# Altium schematic sheet BlockAmpli_Mot.SchDoc: Block_Ampli_Moteur
size A3; Organization: Institut d'Automatisation Industrielle; SheetNumber: 7; SheetTotal: 8; SVN: OUI; CurrentTime: 6; CurrentDate: 5; DocumentFullPathAndName: 8; DocumentName: 9; ModifiedDate: 13; ProjectName: <projet>
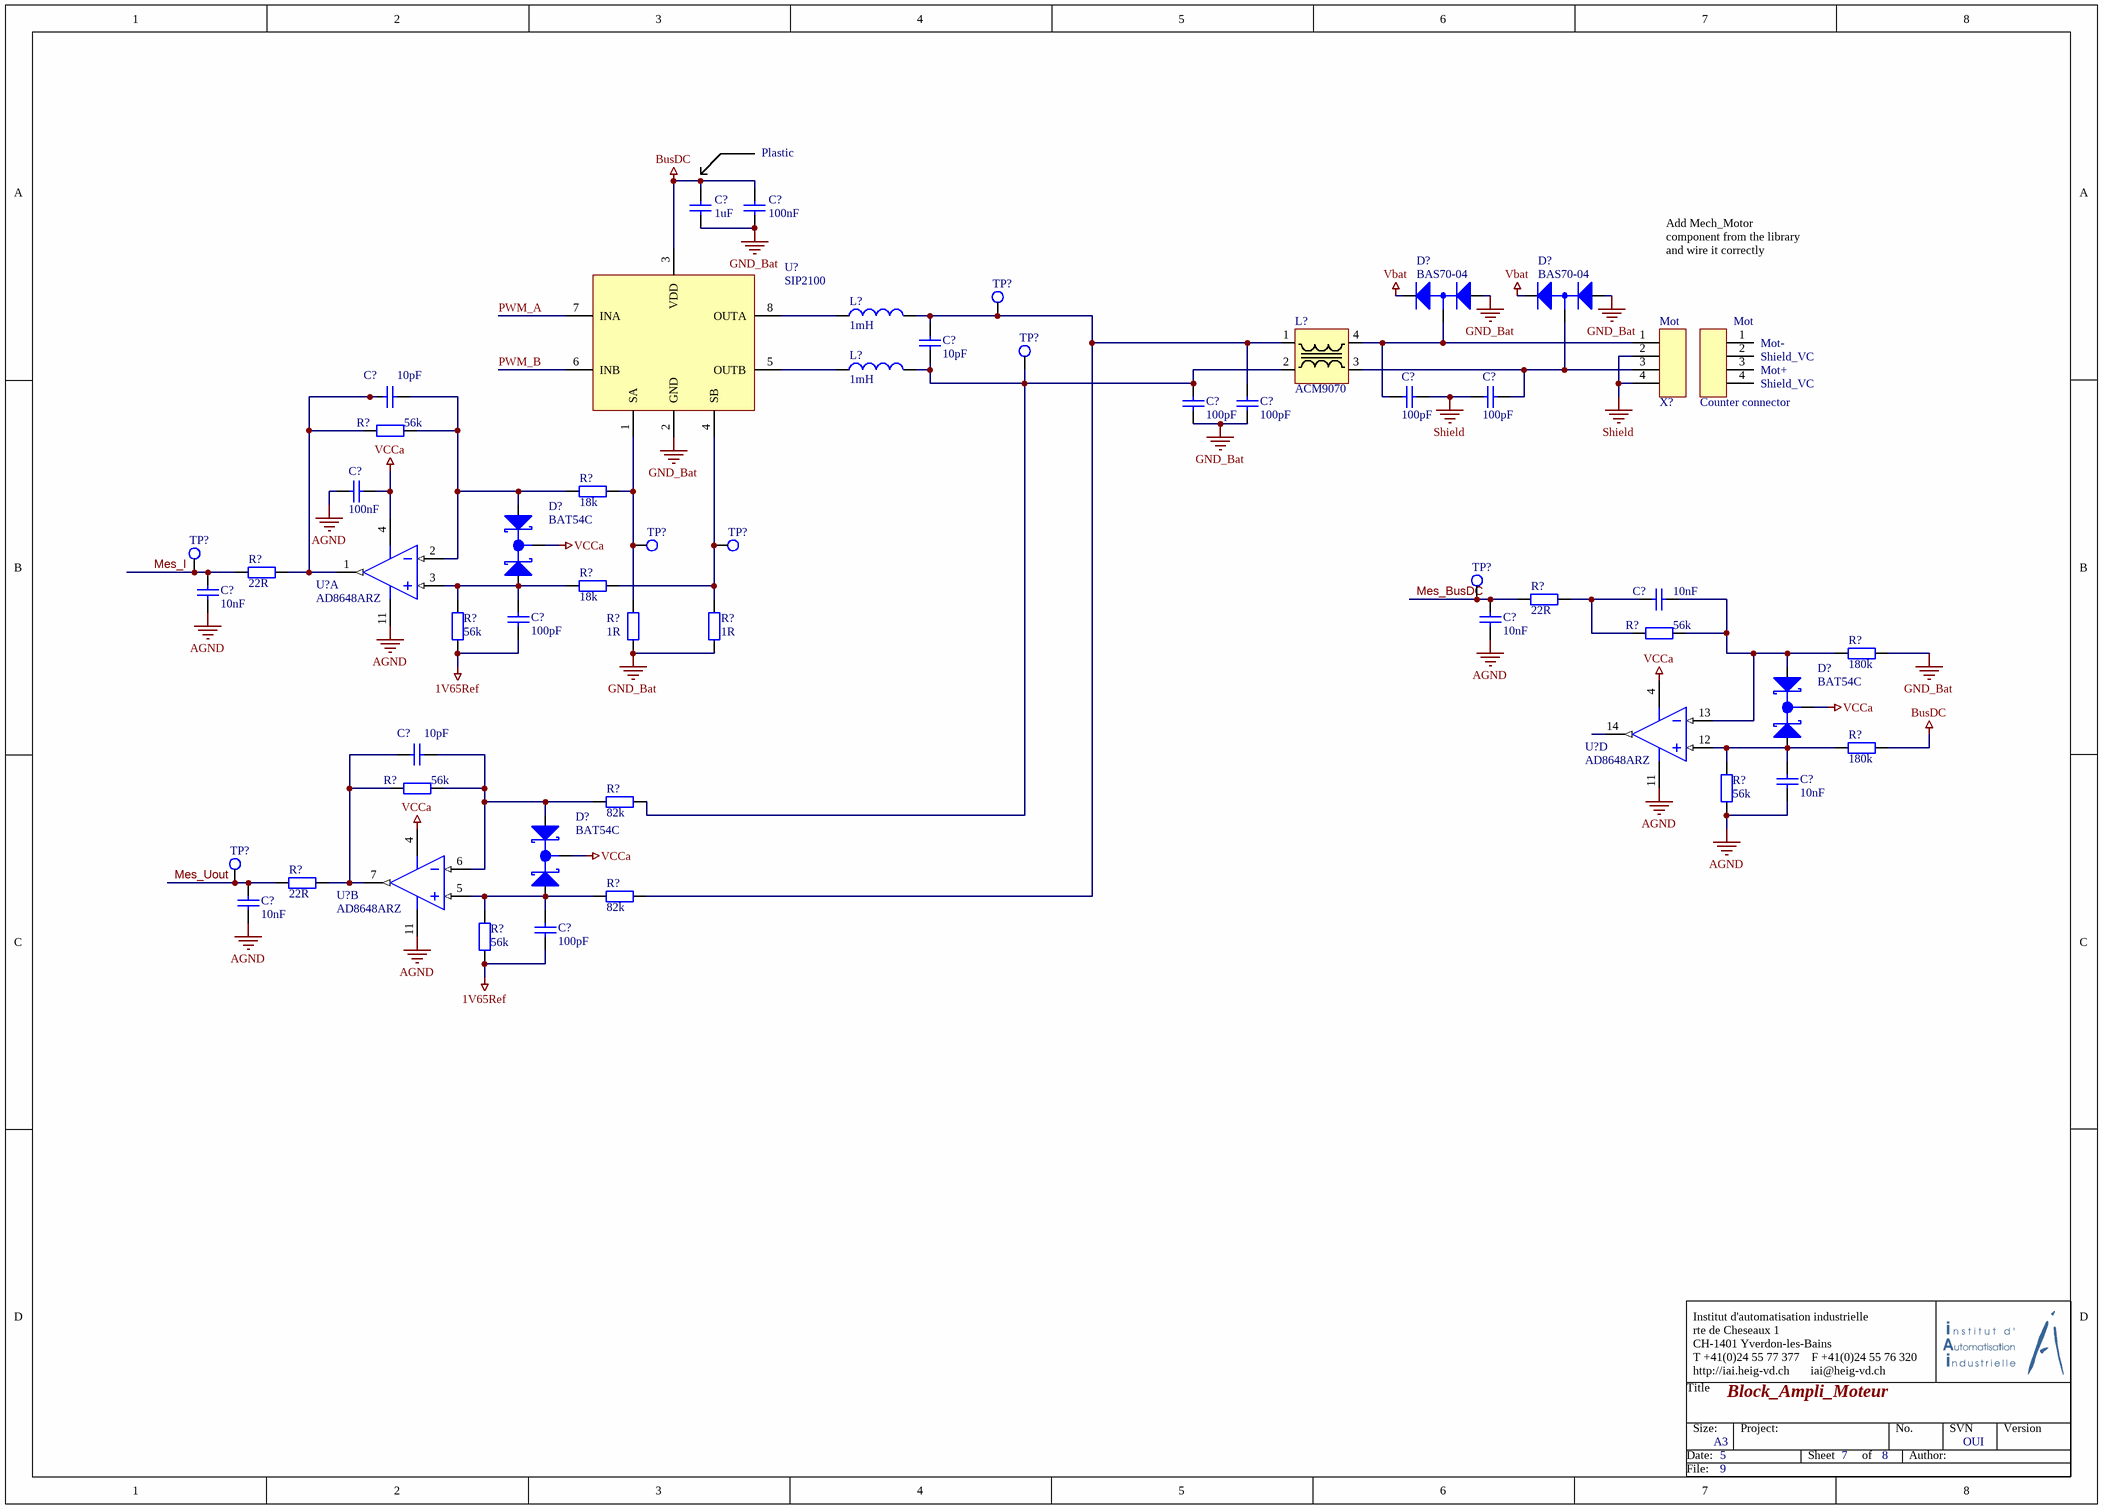
[diagram p0: BlockAmpli_Mot.SchDoc]

## Parts
(Parts that share a designator on the sheet are numbered #1, #2 ... from top to bottom, then left to right.)
C?#1  1uF  [CAP2824]
C?#2  100nF  [CAPC2012N]
C?#3  10pF  [CAPC2012N]
C?#4  10pF  [CAPC2012N]
C?#5  100pF  [CAPC2012N]
C?#6  100pF  [CAPC2012N]
C?#7  100pF  [CAPC2012N]
C?#8  100pF  [CAPC2012N]
C?#9  100nF  [CAPC2012N]
C?#10  10nF  [CAPC2012N]
C?#11  10nF  [CAPC2012N]
C?#12  100pF  [CAPC2012N]
C?#13  10nF  [CAPC2012N]
C?#14  10pF  [CAPC2012N]
C?#15  10nF  [CAPC2012N]
C?#16  10nF  [CAPC2012N]
C?#17  100pF  [CAPC2012N]
D?#1  BAS70-04  [SOT23-3N]
D?#2  BAS70-04  [SOT23-3N]
D?#3  BAT54C  [SOT23-3N]
D?#4  BAT54C  [SOT23-3N]
D?#5  BAT54C  [SOT23-3N]
L?#1  1mH  [B82477G4]
L?#2  ACM9070  [ACM9070]
L?#3  1mH  [B82477G4]
R?#1  56k  [RESC2012N]
R?#2  18k  [RESC2012N]
R?#3  22R  [RESC2012N]
R?#4  18k  [RESC2012N]
R?#5  22R  [RESC2012N]
R?#6  56k  [RESC2012N]
R?#7  56k  [RESC2012N]
R?#8  1R  [RESC2012N]
R?#9  1R  [RESC2012N]
R?#10  180k  [RESC2012N]
R?#11  180k  [RESC2012N]
R?#12  56k  [RESC2012N]
R?#13  82k  [RESC2012N]
R?#14  56k  [RESC2012N]
R?#15  22R  [RESC2012N]
R?#16  82k  [RESC2012N]
R?#17  56k  [RESC2012N]
TP?#1  TP  [Testpoint]  (value not drawn)
TP?#2  TP  [Testpoint]  (value not drawn)
TP?#3  TP  [Testpoint]  (value not drawn)
TP?#4  TP  [Testpoint]  (value not drawn)
TP?#5  TP  [Testpoint]  (value not drawn)
TP?#6  TP  [Testpoint]  (value not drawn)
TP?#7  TP  [Testpoint]  (value not drawn)
U?#1  SIP2100  [SOIC8]
U?#2  AD8648ARZ  [ADI-R-14_M]  (part A of 4)
U?#3  AD8648ARZ  [ADI-R-14_M]  (part D of 4)
U?#4  AD8648ARZ  [ADI-R-14_M]  (part B of 4)
X?  MicroMatch4p  [MicroMatch4p]  (value not drawn)
Y?  Counter connector  (no BOM)

## Nets
1V65Ref: C?#12.1 C?#17.1 R?#7.1 R?#17.1
AGND: C?#9.2 C?#10.1 C?#13.1 C?#15.1 C?#16.1 R?#14.1 U?#2.11(-V) U?#3.11(-V) U?#4.11(-V)
BusDC: C?#1.2 C?#2.2 R?#11.2 U?#1.3(VDD)
GND_Bat: C?#1.1 C?#2.1 C?#7.1 C?#8.1 D?#1.1(A) D?#2.1(A) R?#8.1 R?#9.1 R?#10.2 U?#1.2(GND)
Shield: C?#5.2 C?#6.1 X?.2 X?.4
Vbat: D?#1.2(K) D?#2.2(K)
VCCa: C?#9.1 D?#3.3(K) D?#4.3(K) D?#5.3(K) U?#2.4(+V) U?#3.4(+V) U?#4.4(+V)
Mes_BusDC: C?#13.2 R?#5.1 TP?#6.1
Mes_I: C?#10.2 R?#3.1 TP?#5.1
Mes_Uout: C?#16.2 R?#15.1 TP?#7.1
PWM_A: U?#1.7(INA)
PWM_B: U?#1.6(INB)
NetC?#3_1: C?#3.1 C?#7.2 L?#2.2 L?#3.2 R?#13.2 TP?#2.1
NetC?#3_2: C?#3.2 C?#8.2 L?#1.2 L?#2.1 R?#16.2 TP?#1.1
NetC?#4_1: C?#4.1 R?#1.1 R?#3.2 U?#2.1(OUT_A)
NetC?#4_2: C?#4.2 D?#3.1(A1) R?#1.2 R?#2.1 U?#2.2(-IN_A)
NetC?#5_1: C?#5.1 D?#1.3(A/K) L?#2.4 X?.1
NetC?#6_2: C?#6.2 D?#2.3(A/K) L?#2.3 X?.3
NetC?#11_1: C?#11.1 D?#4.1(A1) R?#6.2 R?#10.1 U?#3.13(-IN_D)
NetC?#11_2: C?#11.2 R?#5.2 R?#6.1
NetC?#12_2: C?#12.2 D?#3.2(A2) R?#4.1 R?#7.2 U?#2.3(+IN_A)
NetC?#14_1: C?#14.1 R?#12.1 R?#15.2 U?#4.7(OUT_B)
NetC?#14_2: C?#14.2 D?#5.1(A1) R?#12.2 R?#13.1 U?#4.6(-IN_B)
NetC?#15_2: C?#15.2 D?#4.2(A2) R?#11.1 R?#14.2 U?#3.12(+IN_D)
NetC?#17_2: C?#17.2 D?#5.2(A2) R?#16.1 R?#17.2 U?#4.5(+IN_B)
NetL?#1_1: L?#1.1 U?#1.8(OUTA)
NetL?#3_1: L?#3.1 U?#1.5(OUTB)
NetR?#2_2: R?#2.2 R?#8.2 TP?#3.1 U?#1.1(SA)
NetR?#4_2: R?#4.2 R?#9.2 TP?#4.1 U?#1.4(SB)

Not connected (* = marked no-connect by the designer): U?#3 14(OUT_D); Y? 1 2 3 4

## Notes on the sheet
- (near C?#2) Plastic
- Add Mech_Motor component from the library and wire it correctly
- (near X?) Mot
- (near Y?) Mot
- (near Y?) Mot-
- (near Y?) Shield_VC
- (near Y?) Mot+
- Title
- Institut d'automatisation industrielle
  rte de Cheseaux 1
  CH-1401 Yverdon-les-Bains
  T +41(0)24 55 77 377    F +41(0)24 55 76 320
  http://iai.heig-vd.ch       iai@heig-vd.ch
- Date:
- Size:
- A3
- Project:
- Sheet
- of
- No.
- Author:
- SVN
- Version
- File:

## Library data of the parts
C?#1 = Cap_1uF_Plastic: Capacitor; Value: 1uF; Supplier 1: Digi-Key; Supplier Part Number 1: 399-6416-1-ND
C?#2 C?#9 = Cap_100nF: Capacitor; Value: 100nF; Supplier 1: Digi-Key; Supplier Part Number 1: 478-1395-1-ND
C?#3 C?#4 C?#14 = Cap_10pF: Capacitor; Value: 10pF; Supplier 1: Digi-Key; Supplier Part Number 1: 311-1099-1-ND
C?#5-C?#8 C?#12 C?#17 = Cap_100pF: Capacitor; Value: 100pF; Supplier 1: Digi-Key; Supplier Part Number 1: 399-1122-1-ND
C?#10 C?#11 C?#13 C?#15 C?#16 = Cap_10nF: Capacitor; Value: 10nF; Supplier 1: Digi-Key; Supplier Part Number 1: 311-1136-1-ND
L?#1 L?#3 = B82477G4105M: Supplier 1: Digi-Key; Supplier Part Number 1: 495-1820-1-ND; Value: 1mH
R?#1 R?#6 R?#7 R?#12 R?#14 R?#17 = Res_56k: Resistor; Value: 56k; Supplier 1: Digi-Key; Supplier Part Number 1: 311-56.0KCRCT-ND
R?#2 R?#4 = Res_18k: Resistor; Value: 18k; Supplier 1: Digi-Key; Supplier Part Number 1: 311-18.0KCRCT-ND
R?#3 R?#5 R?#15 = Res_22R: Resistor; Value: 22R; Supplier 1: Digi-Key; Supplier Part Number 1: 311-22.0CRCT-ND
R?#8 R?#9 = Res_1R: Resistor; Value: 1R; Supplier 1: Digi-Key; Supplier Part Number 1: CRT0805-CY-1R00ELFCT-ND
R?#10 R?#11 = Res_180k: Resistor; Value: 180k; Supplier 1: Digi-Key; Supplier Part Number 1: 311-180KCRCT-ND
R?#13 R?#16 = Res_82k: Resistor; Value: 82k; Supplier 1: Digi-Key; Supplier Part Number 1: 311-82.0KCRCT-ND
TP?#1-TP?#7 = TP: =Value; Supplier 1: Digi-Key; Supplier Part Number 1: 36-5006-ND
U?#2-U?#4 = AD8648ARZ: Quad Channel Wide Bandwidth Operational Amplifier, 22 MHz BW, 12 V/us SR, Industrial, 14-pin SOIC (R-14), Tube; Generic Part Number: AD8648; Manufacturer: Analog Devices; Amplifiers Per Package: 4; Automotive Qualified: Yes; Input Bias Current: 200fA; Input Offset Voltage: 700uV; Iq/Amp: 2mA; Slew Rate: 12V/us; Small Signal Bandwidth: 22MHz; V Span Max: 5.5V; V Span Min: 2.7V; DatasheetVersion: Rev. D; PackageVersion: 060606-A; PackageReference: R-14; PackageDescription: 14-Pin Standard Small Outline Package, Body 8.65 x 3.9 mm, Pitch 1.27 mm; Mounting Technology: Surface Mount; Code_JEDEC: MS-012-AB; PartNumber: AD8648ARZ; ComponentLink1Description: Manufacturer URL; ComponentLink1URL: http://www.analog.com/en/index.html; ComponentLink2Description: Datasheet; ComponentLink2URL: http://www.analog.com/static/imported-files/data_sheets/AD8646_8647_8648.pdf; ComponentLink3Description: Package Specification; ComponentLink3URL: http://www.analog.com/static/imported-files/packages/PKG_PDF/SOIC_Narrow%20(R)/R_14.pdf; Supplier 1: Digi-Key; Supplier Part Number 1: AD8648ARZ-ND
Y? = MicroMatch4p_Header: Counter connector of MicroMatch4p; Supplier 1: Digi-Key; Supplier Part Number 1: A107022CT-ND
D?#1 D?#2 = BAS70-04: Supplier 1: Digi-Key; Supplier Part Number 1: BAS70-04-FDICT-ND
D?#3-D?#5 = BAT54C: Supplier 1: Digi-Key; Supplier Part Number 1: BAT54CLT1GOSCT-ND
L?#2 = ACM9070: Supplier 1: Digi-Key; Supplier Part Number 1: 445-2216-1-ND
U?#1 = SIP2100: Supplier 1: Digi-Key; Supplier Part Number 1: SIP2100DY-T1-GE3CT-ND
X? = MicroMatch4p: Supplier 1: Digi-Key; Supplier Part Number 1: A107022CT-ND